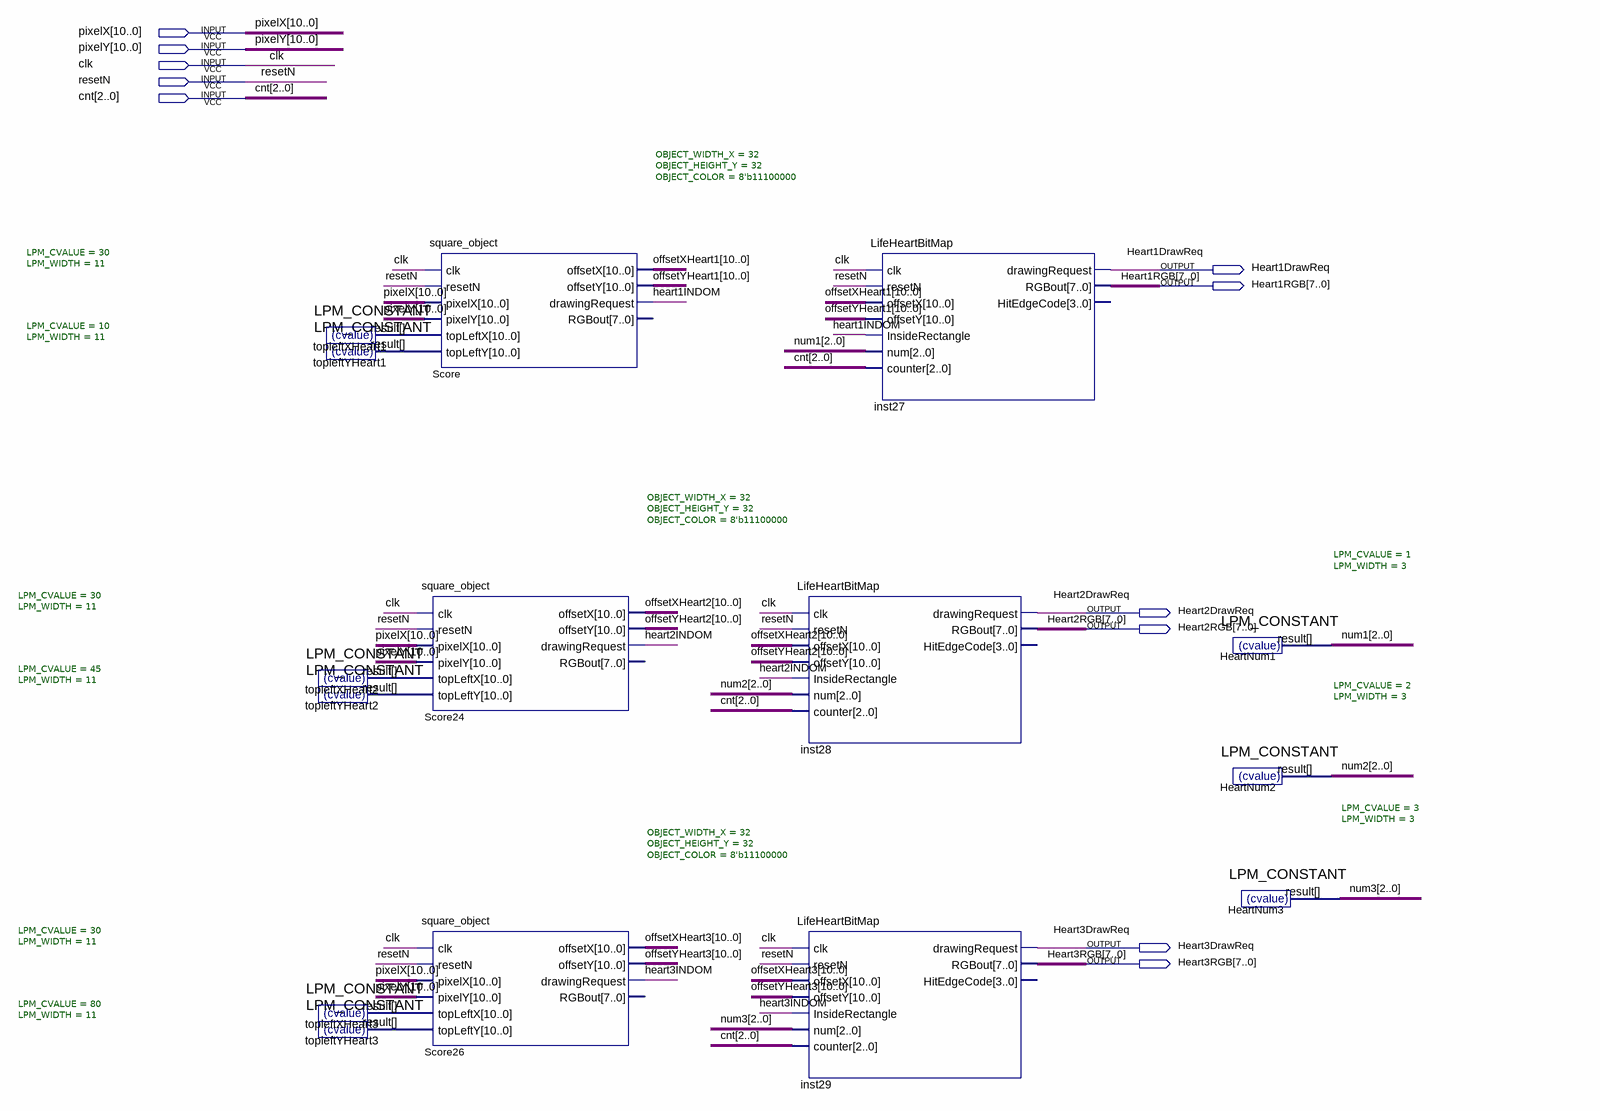
[diagram p0: schematic sheet]
// Quartus schematic Hearts_Block.bdf as structural Verilog: 15 symbols, 11 pins
module Hearts_Block (
  input  [10:0] pixelX,
  input  [10:0] pixelY,
  input  clk,
  input  resetN,
  input  [2:0] cnt,
  output Heart1DrawReq,
  output [7:0] Heart1RGB,
  output Heart2DrawReq,
  output [7:0] Heart2RGB,
  output Heart3DrawReq,
  output [7:0] Heart3RGB
);

  wire heart1INDOM, heart2INDOM, heart3INDOM;
  wire [2:0] num1, num2, num3;
  wire [10:0] offsetXHeart1, offsetXHeart2, offsetXHeart3, offsetYHeart1, offsetYHeart2, offsetYHeart3,
       topleftXHeart1_result, topleftXHeart2_result, topleftXHeart3_result, topleftYHeart1_result,
       topleftYHeart2_result, topleftYHeart3_result;

  LPM_CONSTANT #(.LPM_CVALUE(30), .LPM_WIDTH(11)) topleftXHeart1 (.result(topleftXHeart1_result));
  LPM_CONSTANT #(.LPM_CVALUE(10), .LPM_WIDTH(11)) topleftYHeart1 (.result(topleftYHeart1_result));
  LPM_CONSTANT #(.LPM_CVALUE(30), .LPM_WIDTH(11)) topleftXHeart2 (.result(topleftXHeart2_result));
  LPM_CONSTANT #(.LPM_CVALUE(45), .LPM_WIDTH(11)) topleftYHeart2 (.result(topleftYHeart2_result));
  LPM_CONSTANT #(.LPM_CVALUE(30), .LPM_WIDTH(11)) topleftXHeart3 (.result(topleftXHeart3_result));
  LPM_CONSTANT #(.LPM_CVALUE(80), .LPM_WIDTH(11)) topleftYHeart3 (.result(topleftYHeart3_result));
  square_object #(.OBJECT_WIDTH_X(32), .OBJECT_HEIGHT_Y(32), .OBJECT_COLOR(8'b11100000)) Score (
    .clk(clk), .resetN(resetN), .pixelX(pixelX), .pixelY(pixelY), .topLeftX(topleftXHeart1_result),
    .topLeftY(topleftYHeart1_result), .offsetX(offsetXHeart1), .offsetY(offsetYHeart1),
    .drawingRequest(heart1INDOM));  // open: RGBout
  square_object #(.OBJECT_WIDTH_X(32), .OBJECT_HEIGHT_Y(32), .OBJECT_COLOR(8'b11100000)) Score24 (
    .clk(clk), .resetN(resetN), .pixelX(pixelX), .pixelY(pixelY), .topLeftX(topleftXHeart2_result),
    .topLeftY(topleftYHeart2_result), .offsetX(offsetXHeart2), .offsetY(offsetYHeart2),
    .drawingRequest(heart2INDOM));  // open: RGBout
  square_object #(.OBJECT_WIDTH_X(32), .OBJECT_HEIGHT_Y(32), .OBJECT_COLOR(8'b11100000)) Score26 (
    .clk(clk), .resetN(resetN), .pixelX(pixelX), .pixelY(pixelY), .topLeftX(topleftXHeart3_result),
    .topLeftY(topleftYHeart3_result), .offsetX(offsetXHeart3), .offsetY(offsetYHeart3),
    .drawingRequest(heart3INDOM));  // open: RGBout
  LifeHeartBitMap inst28 (
    .clk(clk), .resetN(resetN), .offsetX(offsetXHeart2), .offsetY(offsetYHeart2),
    .InsideRectangle(heart2INDOM), .num(num2), .counter(cnt), .drawingRequest(Heart2DrawReq),
    .RGBout(Heart2RGB));  // open: HitEdgeCode
  LifeHeartBitMap inst29 (
    .clk(clk), .resetN(resetN), .offsetX(offsetXHeart3), .offsetY(offsetYHeart3),
    .InsideRectangle(heart3INDOM), .num(num3), .counter(cnt), .drawingRequest(Heart3DrawReq),
    .RGBout(Heart3RGB));  // open: HitEdgeCode
  LifeHeartBitMap inst27 (
    .clk(clk), .resetN(resetN), .offsetX(offsetXHeart1), .offsetY(offsetYHeart1),
    .InsideRectangle(heart1INDOM), .num(num1), .counter(cnt), .drawingRequest(Heart1DrawReq),
    .RGBout(Heart1RGB));  // open: HitEdgeCode
  LPM_CONSTANT #(.LPM_CVALUE(1), .LPM_WIDTH(3)) HeartNum1 (.result(num1));
  LPM_CONSTANT #(.LPM_CVALUE(2), .LPM_WIDTH(3)) HeartNum2 (.result(num2));
  LPM_CONSTANT #(.LPM_CVALUE(3), .LPM_WIDTH(3)) HeartNum3 (.result(num3));
endmodule
